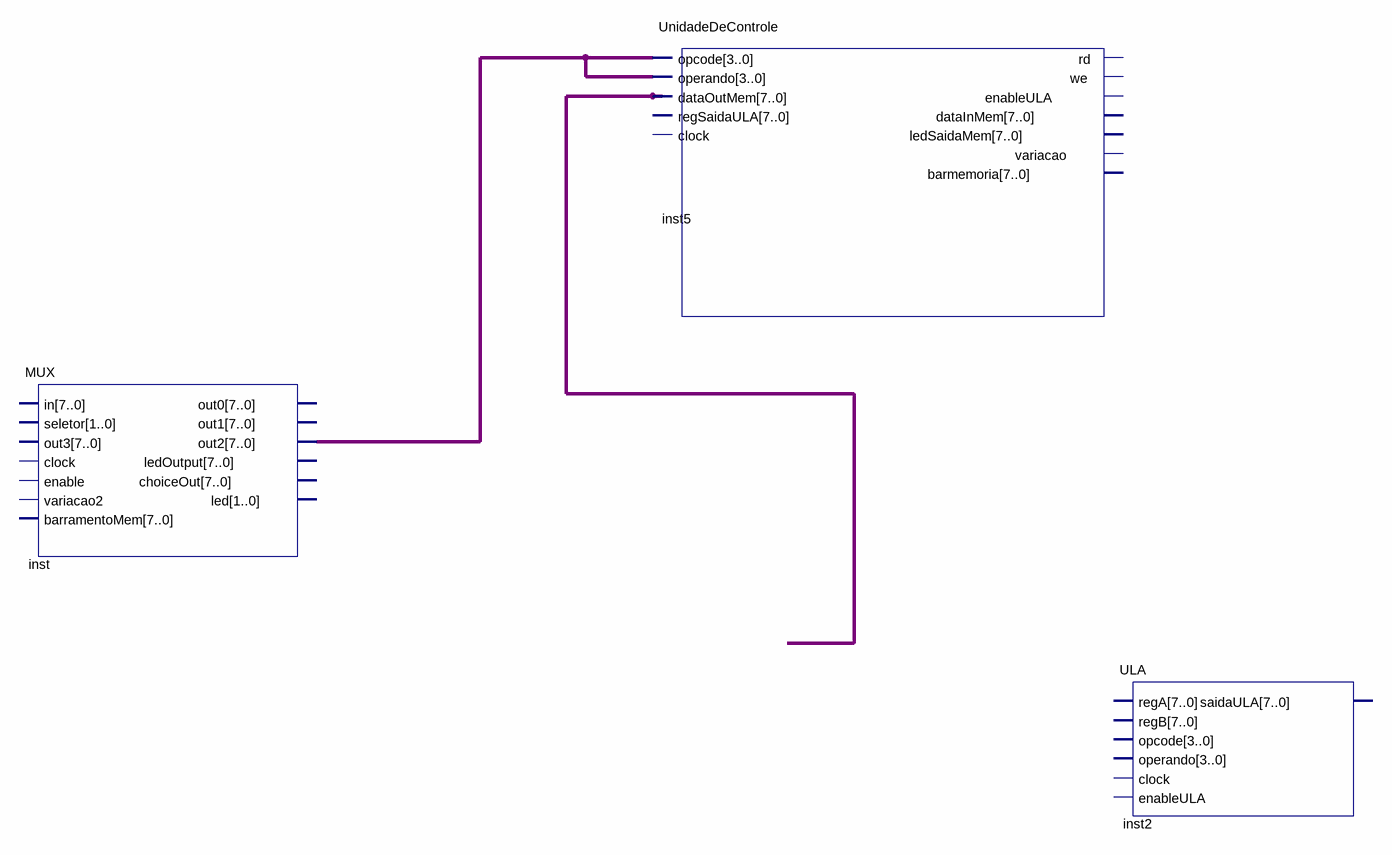
[diagram p0: schematic sheet]
// Quartus schematic processadorSimples.bdf as structural Verilog: 3 symbols, 0 pins
module processadorSimples (
);

  wire [7:0] inst_out2, undriven;

  MUX inst (.out2(inst_out2));  // open: in, seletor, out3, clock, enable, variacao2, barramentoMem, out0, out1, ledOutput, choiceOut, led
  UnidadeDeControle inst5 (
    .opcode(inst_out2), .operando(inst_out2), .dataOutMem(undriven));  // open: regSaidaULA, clock, rd, we, enableULA, dataInMem, ledSaidaMem, variacao, barmemoria
  ULA inst2 ();  // open: regA, regB, opcode, operando, clock, enableULA, saidaULA
endmodule
